# Altium schematic sheet RedBeanSprout_Sch.SchDoc: RedBeanSprout
size 152 x 152 mm; Author: Hom; CompanyName: KitSprout; DrawnBy: Hom; Engineer: Hom; Organization: KitSprout; Revision: A; SheetNumber: 1; SheetTotal: 1; Version: 2.2; LibVersion: 1.2; PageSetup: Record=PageOptions|CenterHorizontal=True|CenterVertical=True|PrintScale=1.00|XCorrection=1.00|YCorrection=1.00|PrintKind=0|BorderSize=5000000|LeftOffset=0|BottomOffset=0|Orientation=1|PaperLength=1000|PaperWidth=1000|Scale=100|PaperSource=7|PrintQuality=-3|MediaType=1|DitherType=10|PrintScaleMode=0|PaperKind=A4|PaperIndex=9
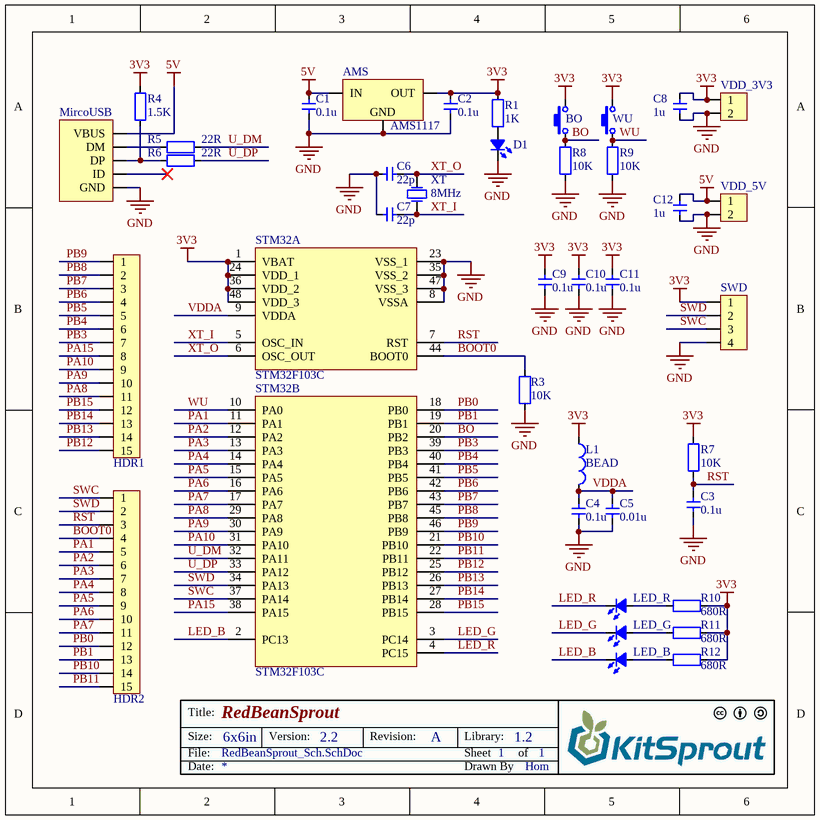
[diagram p0: RedBeanSprout_Sch.SchDoc]

## Parts
AMS  AMS1117  [SOT223-3]
BO  ButtonTACT_3x6x2.5_180  [ButtonTACT_3x6x2.5_180]  (value not drawn)
C1  value 0.1u  [CAP_0603]  (hidden comment: Cap_0603)
C2  value 0.1u  [CAP_0603]  (hidden comment: Cap_0603)
C3  value 0.1u  [CAP_0603]  (hidden comment: Cap_0603)
C4  value 0.1u  [CAP_0603]  (hidden comment: Cap_0603)
C5  value 0.01u  [CAP_0603]  (hidden comment: Cap_0603)
C6  value 22p  [CAP_0603]  (hidden comment: Cap_0603)
C7  value 22p  [CAP_0603]  (hidden comment: Cap_0603)
C8  value 1u  [CAP_0603]  (hidden comment: Cap_0603)
C9  value 0.1u  [CAP_0603]  (hidden comment: Cap_0603)
C10  value 0.1u  [CAP_0603]  (hidden comment: Cap_0603)
C11  value 0.1u  [CAP_0603]  (hidden comment: Cap_0603)
C12  value 1u  [CAP_0603]  (hidden comment: Cap_0603)
D1  LED_0603  [LED_0603_YELLOW]  (value not drawn)
HDR1  HDR1x15_2.54  [HDR1X15_2.54_180]  (value not drawn)
HDR2  HDR1x15_2.54  [HDR1X15_2.54_180]  (value not drawn)
L1  value BEAD  [IND_0603]  (hidden comment: Ind_0603)
LED_B  LED_0603  [LED_0603_BLUE]  (value not drawn)
LED_G  LED_0603  [LED_0603_GREEN]  (value not drawn)
LED_R  LED_0603  [LED_0603_RED]  (value not drawn)
MircoUSB  USB_Micro  [USB_Micro-AB]  (value not drawn)
R1  value 1K  [RES_0603]  (hidden comment: Res_0603)
R3  value 10K  [RES_0603]  (hidden comment: Res_0603)
R4  value 1.5K  [RES_0603]  (hidden comment: Res_0603)
R5  value 22R  [RES_0603]  (hidden comment: Res_0603)
R6  value 22R  [RES_0603]  (hidden comment: Res_0603)
R7  value 10K  [RES_0603]  (hidden comment: Res_0603)
R8  value 10K  [RES_0603]  (hidden comment: Res_0603)
R9  value 10K  [RES_0603]  (hidden comment: Res_0603)
R10  value 680R  [RES_0603]  (hidden comment: Res_0603)
R11  value 680R  [RES_0603]  (hidden comment: Res_0603)
R12  value 680R  [RES_0603]  (hidden comment: Res_0603)
STM32  STM32F103C  [LQFP_P0.5_48]  (parts A,B of 2)
SWD  HDR1x4_2.54  [HDR1X4_2.54_90F]  (value not drawn)
VDD_3V3  HDR1x2_2.54  [HDR1X2_2.54_180]  (value not drawn)
VDD_5V  HDR1x2_2.54  [HDR1X2_2.54_180]  (value not drawn)
WU  ButtonTACT_3x6x2.5_180  [ButtonTACT_3x6x2.5_180]  (value not drawn)
XT  value 8MHz  [XT_5032_2]  (hidden comment: XTAL_5032_2P)

## Nets
3V3: AMS.2(OUT) BO.2 C2.2 C8.2 C9.2 C10.2 C11.2 L1.1 R1.2 R4.1 R7.2 R10.1 R11.1 R12.1 STM32.1(VBAT) STM32.24(VDD_1) STM32.36(VDD_2) STM32.48(VDD_3) SWD.1 VDD_3V3.1 WU.2
5V: AMS.3(IN) C1.2 C12.2 MircoUSB.1(VBUS) VDD_5V.1
GND: AMS.1(GND) C1.1 C2.1 C3.1 C4.1 C5.1 C6.2 C7.2 C8.1 C9.1 C10.1 C11.1 C12.1 D1.2(K) MircoUSB.5(GND) R3.1 R8.1 R9.1 STM32.8(VSSA) STM32.23(VSS_1) STM32.35(VSS_2) STM32.47(VSS_3) SWD.4 VDD_3V3.2 VDD_5V.2
BO: BO.1 R8.2 STM32.20(PB2)
BOOT0: HDR2.4 R3.2 STM32.44(BOOT0)
LED_B: LED_B.2(K) STM32.2(PC13)
LED_G: LED_G.2(K) STM32.3(PC14)
LED_R: LED_R.2(K) STM32.4(PC15)
PA1: HDR2.5 STM32.11(PA1)
PA2: HDR2.6 STM32.12(PA2)
PA3: HDR2.7 STM32.13(PA3)
PA4: HDR2.8 STM32.14(PA4)
PA5: HDR2.9 STM32.15(PA5)
PA6: HDR2.10 STM32.16(PA6)
PA7: HDR2.11 STM32.17(PA7)
PA8: HDR1.11 STM32.29(PA8)
PA9: HDR1.10 STM32.30(PA9)
PA10: HDR1.9 STM32.31(PA10)
PA15: HDR1.8 STM32.38(PA15)
PB0: HDR2.12 STM32.18(PB0)
PB1: HDR2.13 STM32.19(PB1)
PB3: HDR1.7 STM32.39(PB3)
PB4: HDR1.6 STM32.40(PB4)
PB5: HDR1.5 STM32.41(PB5)
PB6: HDR1.4 STM32.42(PB6)
PB7: HDR1.3 STM32.43(PB7)
PB8: HDR1.2 STM32.45(PB8)
PB9: HDR1.1 STM32.46(PB9)
PB10: HDR2.14 STM32.21(PB10)
PB11: HDR2.15 STM32.22(PB11)
PB12: HDR1.15 STM32.25(PB12)
PB13: HDR1.14 STM32.26(PB13)
PB14: HDR1.13 STM32.27(PB14)
PB15: HDR1.12 STM32.28(PB15)
RST: C3.2 HDR2.3 R7.1 STM32.7(RST)
SWC: HDR2.1 STM32.37(PA14) SWD.3
SWD: HDR2.2 STM32.34(PA13) SWD.2
U_DM: R5.2 STM32.32(PA11)
U_DP: R6.2 STM32.33(PA12)
VDDA: C4.2 C5.2 L1.2 STM32.9(VDDA)
WU: R9.2 STM32.10(PA0) WU.1
XT_I: C7.1 STM32.5(OSC_IN) XT.1(OSC1)
XT_O: C6.1 STM32.6(OSC_OUT) XT.2(OSC2)
NetD1_1: D1.1(A) R1.1
NetLED_B_1: LED_B.1(A) R12.2
NetLED_G_1: LED_G.1(A) R11.2
NetLED_R_1: LED_R.1(A) R10.2
NetMircoUSB_2: MircoUSB.2(DM) R5.1
NetMircoUSB_3: MircoUSB.3(DP) R4.2 R6.1

Not connected (* = marked no-connect by the designer): MircoUSB 4(ID)*

## Notes on the sheet
- Title:
- Size:
- Date:
- File:
- 6x6in
- Version:
- Revision:
- Sheet
- Drawn By
- Library:
- of

## Library data of the parts
AMS = AMS1117: Power
BO WU = ButtonTACT_3x6x2.5_180: Button
C1-C12 = Cap_0603: Capacitor
D1 LED_B LED_G LED_R = LED_0603: LED
HDR1 HDR2 = HDR1x15_2.54: Header
L1 = Ind_0603: Inductor
MircoUSB = USB_Micro: USB
R1 R3-R12 = Res_0603: Resistor
STM32 = STM32F103C: MCU
SWD = HDR1x4_2.54: Header
VDD_3V3 VDD_5V = HDR1x2_2.54: Header
XT = XTAL_5032_2P: Crystal Oscillator